# EAGLE design QT Servo (EAGLE 9.7.0)
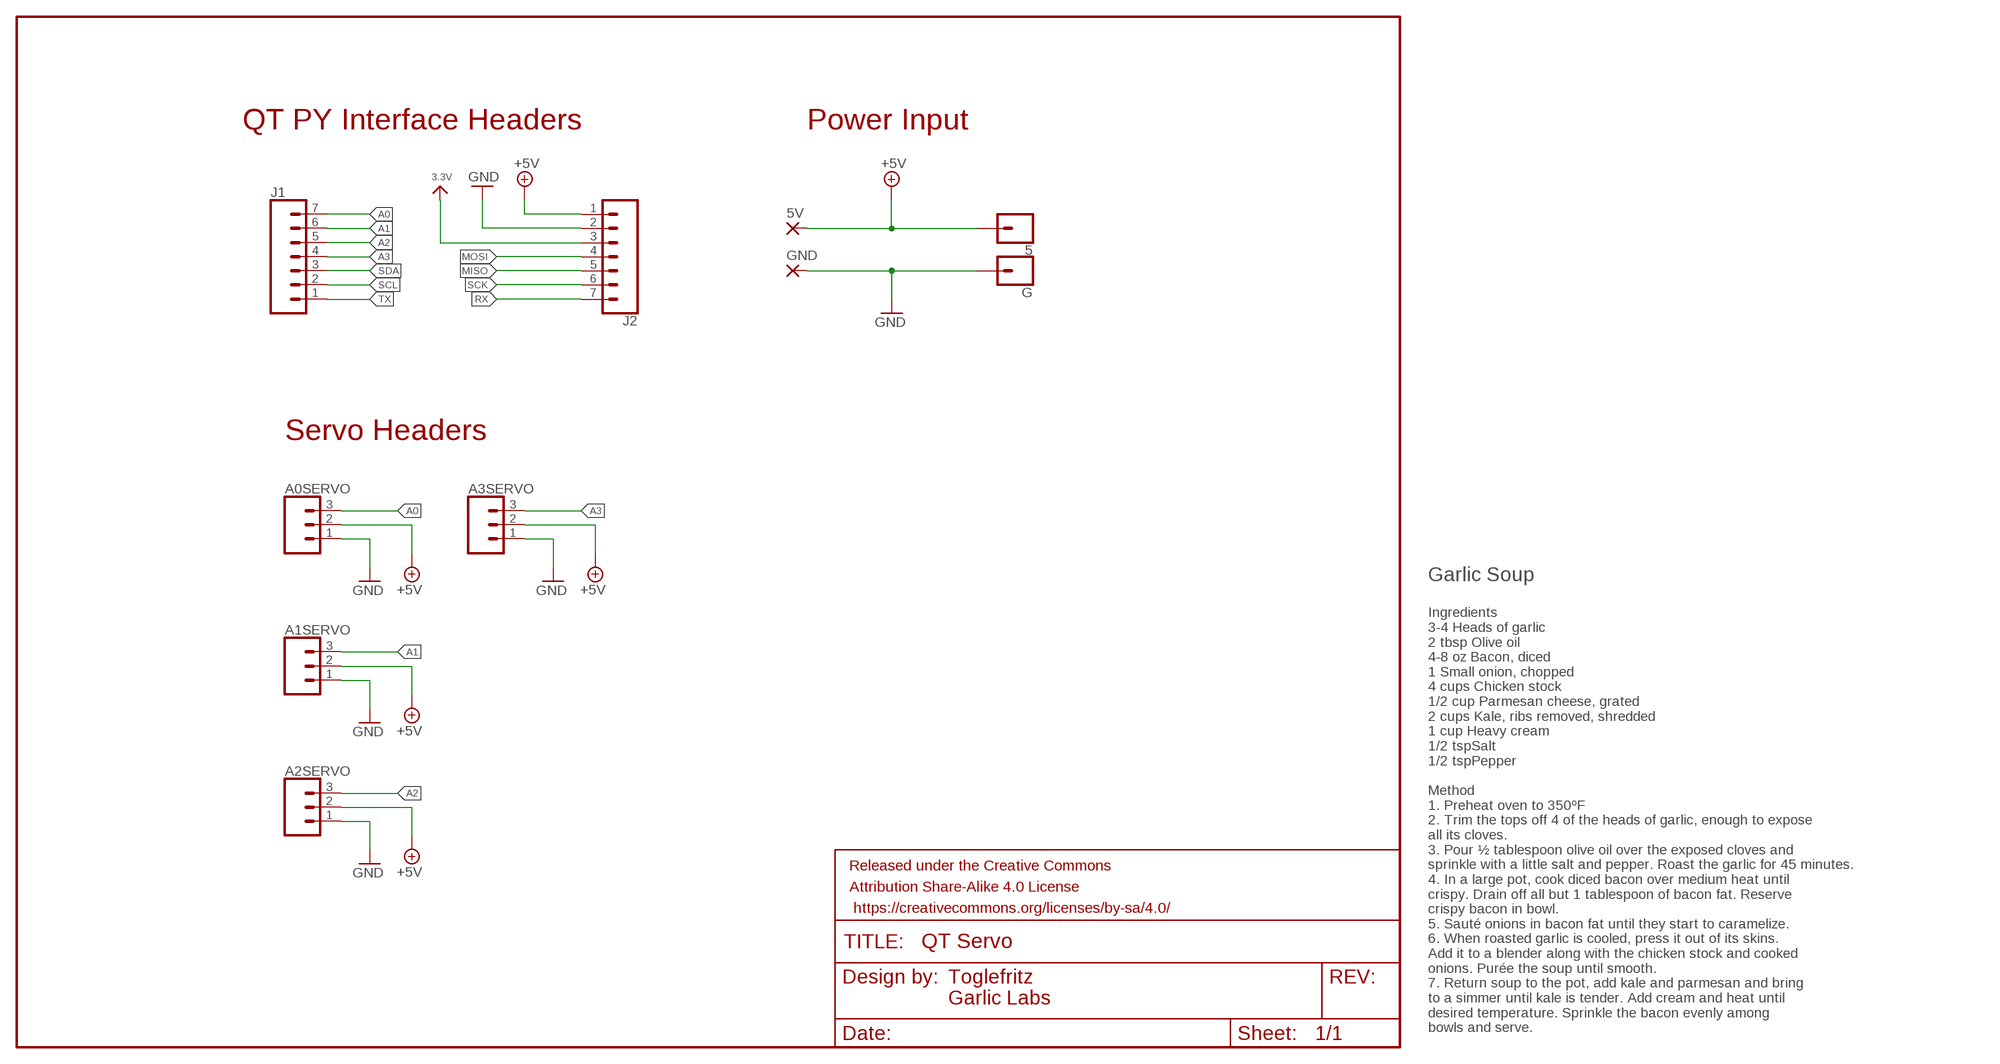
[diagram p0: schematic, sheet 1]

## Parts
5  CONN_01PTH_LONGPAD  [1X01_LONGPAD]
5V  SMD5  [SMD2,54-5,08]
A0SERVO  CONN_03  [1X03]
A1SERVO  CONN_03  [1X03]
A2SERVO  CONN_03  [1X03]
A3SERVO  CONN_03  [1X03]
FRAME1  FRAME-LETTERNO_PACKAGE  [DUMMY]
G  CONN_01PTH_LONGPAD  [1X01_LONGPAD]
GND  SMD5  [SMD2,54-5,08]
J1  CONN_07NO_SILK  [1X07_NO_SILK]
J2  CONN_07NO_SILK  [1X07_NO_SILK]

## Nets
3.3V: J2.3
+5V [power]: 5.1 5V.1(P) A0SERVO.2 A1SERVO.2 A2SERVO.2 A3SERVO.2 J2.1
A0: A0SERVO.3 J1.7
A1: A1SERVO.3 J1.6
A2: A2SERVO.3 J1.5
A3: A3SERVO.3 J1.4
GND [power]: A0SERVO.1 A1SERVO.1 A2SERVO.1 A3SERVO.1 G.1 GND.1(P) J2.2
MISO: J2.5
MOSI: J2.4
RX: J2.7
SCK: J2.6
SCL: J1.2
SDA: J1.3
TX: J1.1

## Notes on the sheet
- QT PY Interface Headers | Power Input
- Servo Headers
- Garlic Soup
- Toglefritz
  Garlic Labs
- Ingredients
  3-4 Heads of garlic
  2 tbsp Olive oil
  4-8 oz Bacon, diced
  1 Small onion, chopped
  4 cups Chicken stock
  1/2 cup Parmesan cheese, grated
  2 cups Kale, ribs removed, shredded
  1 cup Heavy cream
  1/2 tspSalt
  1/2 tspPepper
  
  Method
  1. Preheat oven to 350ºF
  2. Trim the tops off 4 of the heads of garlic, enough to expose 
  all its cloves. 
  3. Pour ½ tablespoon olive oil over the exposed cloves and 
  sprinkle with a little salt and pepper. Roast the garlic for 45 minutes.
  4. In a large pot, cook diced bacon over medium heat until
  crispy. Drain off all but 1 tablespoon of bacon fat. Reserve 
  crispy bacon in bowl. 
  5. Sauté onions in bacon fat until they start to caramelize.
  6. When roasted garlic is cooled, press it out of its skins. 
  Add it to a blender along with the chicken stock and cooked 
  onions. Purée the soup until smooth.
  7. Return soup to the pot, add kale and parmesan and bring 
  to a simmer until kale is tender. Add cream and heat until 
  desired temperature. Sprinkle the bacon evenly among 
  bowls and serve.

## Library data of the parts
5 G = Push-Fit_CONN:CONN_01: Single connection point. Often used as Generic Header-pin footprint for 0.1 inch spaced/style header connections On any of the 0.1 inch spaced packages, you can populate with these: Break Away Headers - Straight <https://www.sparkfun.com/products/116> (PRT-00116) Break Away Male Headers - Right Angle <https://www.sparkfun.com/products/553> (PRT-00553) Female Headers <https://www.sparkfun.com/products/115> (PRT-00115) Break Away Headers - Machine Pin <https://www.sparkfun.com/products/117> (PRT-00117) Break Away Female Headers - Swiss Machine Pin <https://www.sparkfun.com/products/743> (PRT-00743) This device is also useful as a general connection point to wire up your design to another part of your project. Our various solder wires solder well into these plated through hole pads. Hook-Up Wire - Assortment (Stranded, 22 AWG) <https://www.sparkfun.com/products/11375> (PRT-11375) Hook-Up Wire - Assortment (Solid Core, 22 AWG) <https://www.sparkfun.com/products/11367> (PRT-11367) View the entire wire category on our website here <https://www.sparkfun.com/categories/141> Special notes: SMTSO-256-ET is a "flush mount" nut for a 4-40 screw. We mostly use this on specialty testbeds; it is a nice way to connect hardware to your PCB at an adjustable hieght. Also note, the SNAP packages are for using a snappable style connector. We sell a baggie of snaps and they are also used on two LilyPad designs: Snap Assortment - 30 pack (male and female) <https://www.sparkfun.com/products/11347> (DEV-11347) LilyPad Arduino SimpleSnap <https://www.sparkfun.com/products/10941> (DEV-10941) LilyPad SimpleSnap Protoboard <https://www.sparkfun.com/products/10940> (DEV-10940)
5V GND = wirepad:SMD5: SMD PAD
A0SERVO A1SERVO A2SERVO A3SERVO = Push-Fit_CONN:CONN_03: Multi connection point. Often used as Generic Header-pin footprint for 0.1 inch spaced/style header connections On any of the 0.1 inch spaced packages, you can populate with these: Break Away Headers - Straight <https://www.sparkfun.com/products/116> (PRT-00116) Break Away Male Headers - Right Angle <https://www.sparkfun.com/products/553> (PRT-00553) Female Headers <https://www.sparkfun.com/products/115> (PRT-00115) Break Away Headers - Machine Pin <https://www.sparkfun.com/products/117> (PRT-00117) Break Away Female Headers - Swiss Machine Pin <https://www.sparkfun.com/products/743> (PRT-00743) Stackable Header - 3 Pin (Female, 0.1") <https://www.sparkfun.com/products/13875> (PRT-13875) For SCREWTERMINALS and SPRING TERMINALS visit here: Screw Terimnals on SparkFun.com <https://www.sparkfun.com/search/results?term=Screw+Terminals> (5mm/3.5mm/2.54mm spacing) This device is also useful as a general connection point to wire up your design to another part of your project. Our various solder wires solder well into these plated through hole pads. Hook-Up Wire - Assortment (Stranded, 22 AWG) <https://www.sparkfun.com/products/11375> (PRT-11375) Hook-Up Wire - Assortment (Solid Core, 22 AWG) <https://www.sparkfun.com/products/11367> (PRT-11367) View the entire wire category on our website here <https://www.sparkfun.com/categories/141> Special notes: Molex polarized connector foot print use with SKU : PRT-08232 with associated crimp pins and housings.
FRAME1 = SparkFun-Aesthetics:FRAME-LETTER: Schematic Frame - Letter Standard 8.5x11 US Letter frame; DESIGNER: Nobody; VERSION: v01
J1 J2 = Push-Fit_CONN:CONN_07: Multi connection point. Often used as Generic Header-pin footprint for 0.1 inch spaced/style header connections On any of the 0.1 inch spaced packages, you can populate with these: Break Away Headers - Straight <https://www.sparkfun.com/products/116> (PRT-00116) Break Away Male Headers - Right Angle <https://www.sparkfun.com/products/553> (PRT-00553) Female Headers <https://www.sparkfun.com/products/115> (PRT-00115) Break Away Headers - Machine Pin <https://www.sparkfun.com/products/117> (PRT-00117) Break Away Female Headers - Swiss Machine Pin <https://www.sparkfun.com/products/743> (PRT-00743) For SCREWTERMINALS and SPRING TERMINALS visit here: Screw Terimnals on SparkFun.com <https://www.sparkfun.com/search/results?term=Screw+Terminals> (5mm/3.5mm/2.54mm spacing) This device is also useful as a general connection point to wire up your design to another part of your project. Our various solder wires solder well into these plated through hole pads. Hook-Up Wire - Assortment (Stranded, 22 AWG) <https://www.sparkfun.com/products/11375> (PRT-11375) Hook-Up Wire - Assortment (Solid Core, 22 AWG) <https://www.sparkfun.com/products/11367> (PRT-11367) View the entire wire category on our website here <https://www.sparkfun.com/categories/141> Special notes: Molex polarized connector foot print use with SKU : PRT-08231 with associated crimp pins and housings. 1MM SMD Version SKU: PRT-10208 NOTES ON THE VARIANTS LOCK and LOCK_LONGPADS... This footprint was designed to help hold the alignment of a through-hole component (i.e. 6-pin header) while soldering it into place. You may notice that each hole has been shifted either up or down by 0.005 of an inch from it's more standard position (which is a perfectly straight line). This slight alteration caused the pins (the squares in the middle) to touch the edges of the holes. Because they are alternating, it causes a "brace" to hold the component in place. 0.005 has proven to be the perfect amount of "off-center" position when using our standard breakaway headers. Although looks a little odd when you look at the bare footprint, once you have a header in there, the alteration is very hard to notice. Also,if you push a header all the way into place, it is covered up entirely on the bottom side.

## Net classes
1 power: width 0.254 mm
2 gnd: width 0.254 mm

## Board
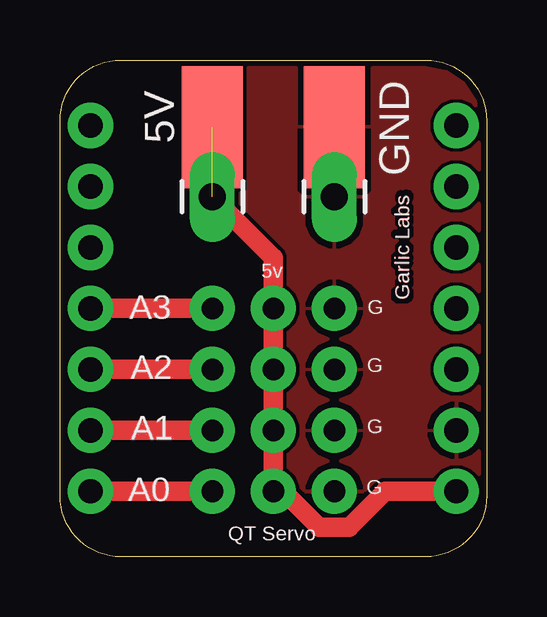
[diagram p1: board, top side]
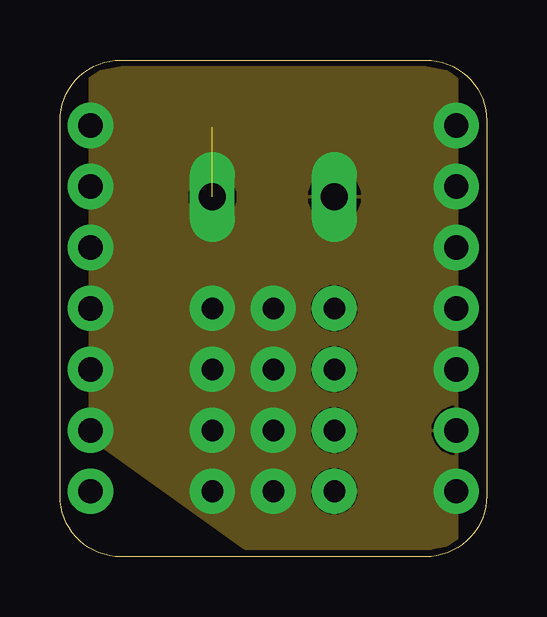
[diagram p2: board, inner layer Route2]
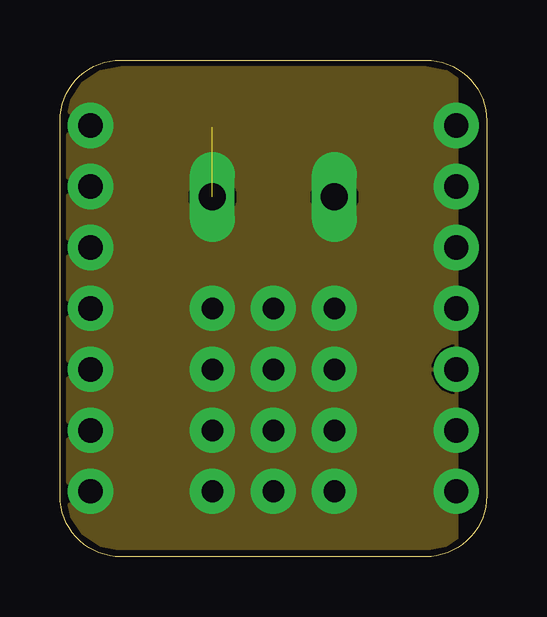
[diagram p3: board, inner layer Route15]
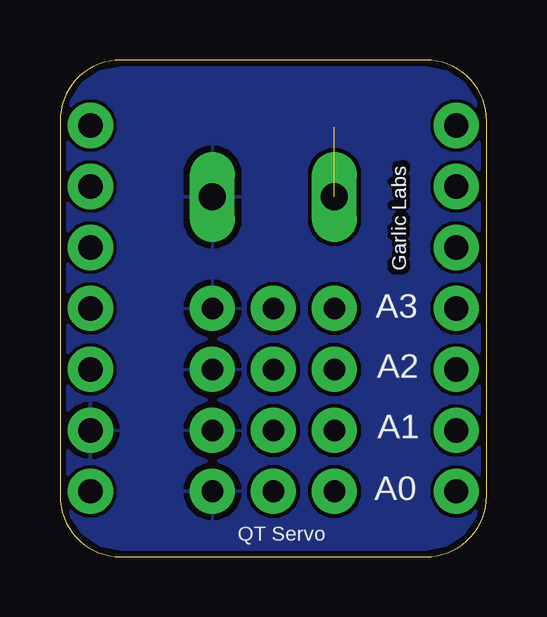
[diagram p4: board, bottom side, seen from below]

Size 17.78 x 20.7 mm. Coordinates in mm from the lower left corner, seen from the top.
Outline: 17.78,18.16 17.78,2.54 arc-90 15.24,0 2.54,0 arc-90 0,2.54 0,18.16 arc-90 2.54,20.7 15.24,20.7 arc-90 17.78,18.16
Copper layers (1*16): Top / Bottom
Stack-up 2 Layer Stack: Top SolderMask SR:Green 0.0254mm Dk 4.3 / Top Surface Finish Lead-Free 0.02mm / Top CuFoil:007 0.035mm / Dielectric-1 Core:084 1.067mm / Bottom CuFoil:007 0.035mm / Bottom Surface Finish Lead-Free 0.02mm / Bottom SolderMask SR:Green 0.0254mm Dk 4.3
Design rules "adafruit 6-6 *": minimum track width 6mil, minimum drill 15.5mil, track to track 6mil, track to pad 6mil, pad to pad 6mil, via to via 6mil, smd to smd 6mil, copper to edge 10mil, drill to drill 8mil, minimum pad ring 10mil, minimum via ring 8mil, stop-mask expansion 2mil, vias tented up to drill 20mil, thermal gap 10mil

### Footprints (pad centres in the part's own frame; a part is rotated, then mirrored left to right if it is on the bottom)
1X01_LONGPAD = drill 1.118 pad 1.88 long: 1 0,0
SMD2,54-5,08 = smd 2.54 x 5.08: 1 0,0
1X03 = drill 0.9 pad 1.88: 1 0,0; 2 2.54,0; 3 5.08,0
1X07_NO_SILK = drill 1.016 pad 1.88: 1 0,0; 2 2.54,0; 3 5.08,0; 4 7.62,0; 5 10.16,0; 6 12.7,0; 7 15.24,0

### Placement (x,y rotation side)
5  6.35,15 0 top
5V  6.35,17.91 0 top
A0SERVO  11.43,2.73 180 top
A1SERVO  11.43,5.27 180 top
A2SERVO  11.43,7.81 180 top
A3SERVO  11.43,10.35 180 top
FRAME1  -6.53,-4.76 0 top  (outside the outline)
G  11.43,15 0 top
GND  11.43,17.91 0 top
J1  1.27,17.97 270 top
J2  16.51,2.73 90 top

### Tracks (layer width: path | path; a pad name or v marks a point on that pad's centre or on a via)
3.3V
  pour Route15: 16.6,20.79 -0.08,20.79 -0.08,0.29 16.6,0.29
+5V  (1 unrouted)
  Top 0.813: J2.1 13.55,2.73 12.05,1.23 10.81,1.23 9.31,2.73 A0SERVO.2 A1SERVO.2 A2SERVO.2 A3SERVO.2 8.89,12.46 5.1
A0
  Top 0.813: A0SERVO.3 J1.7
A1
  Top 0.813: A1SERVO.3 J1.6
A2
  Top 0.813: J1.5 A2SERVO.3
A3
  Top 0.813: A3SERVO.3 J1.4
GND
  pour Route2: 16.59,20.78 1.19,20.78 1.19,4.94 7.67,0.3 16.59,0.3
  pour Bottom: 0,18.16 0,2.54 arc90 2.54,0 15.24,0 arc90 17.78,2.54 17.78,18.16 arc90 15.24,20.7 2.54,20.7 arc90
  pour Top: 0,18.16 0,2.54 arc90 2.54,0 15.24,0 arc90 17.78,2.54 17.78,18.16 arc90 15.24,20.7 2.54,20.7 arc90

### Text on the board
Top: Garlic Labs
Bottom: Garlic Labs
tPlace: 5v | Garlic Labs | A3 | G | G | A2 | A1 | G | G | A0 | QT Servo
bPlace: Garlic Labs | A3 | A2 | A1 | A0 | QT Servo